# Altium schematic sheet Input_TAB.SchDoc
size A4; SheetNumber: 7; SheetTotal: 9
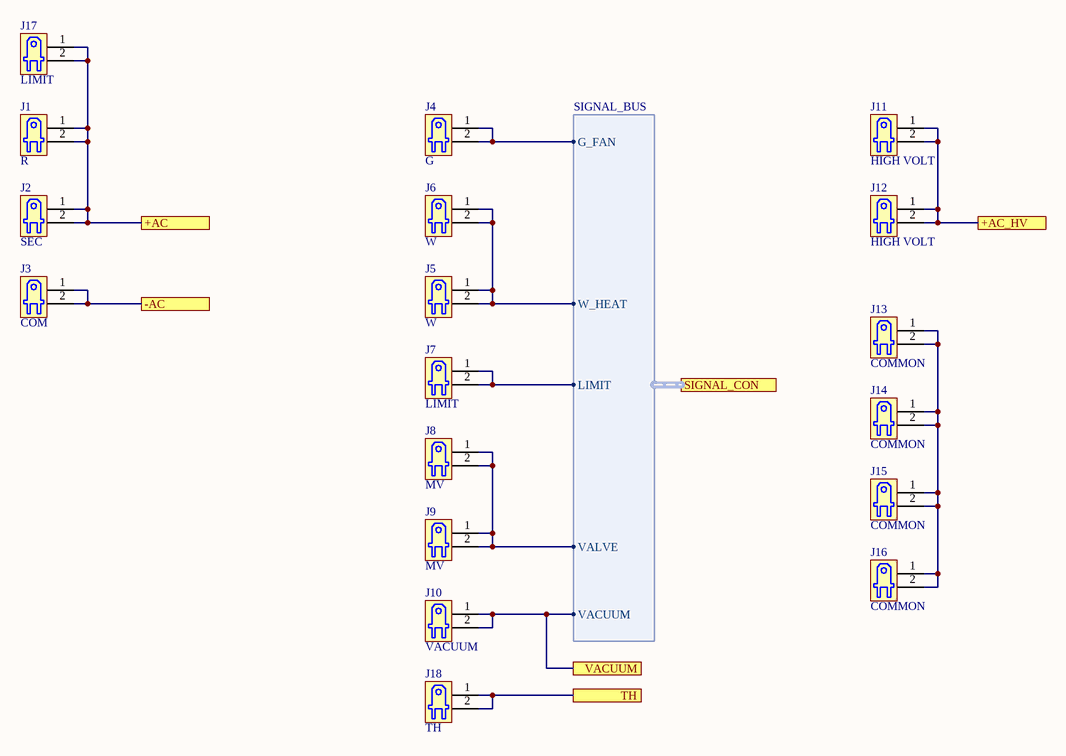
[diagram p0: Input_TAB.SchDoc]

## Parts
J1  R  [TAB250-250P]
J2  SEC  [TAB250-250P]
J3  COM  [TAB250-250P]
J4  G  [TAB250-250P]
J5  W  [TAB250-250P]
J6  W  [TAB250-250P]
J7  LIMIT  [TAB250-250P]
J8  MV  [TAB250-250P]
J9  MV  [TAB250-250P]
J10  VACUUM  [TAB250-250P]
J11  HIGH VOLT  [TAB250-250P]
J12  HIGH VOLT  [TAB250-250P]
J13  COMMON  [TAB250-250P]
J14  COMMON  [TAB250-250P]
J15  COMMON  [TAB250-250P]
J16  COMMON  [TAB250-250P]
J17  LIMIT  [TAB250-250P]
J18  TH  [TAB250-250P]

## Ports
+AC, +AC_HV, -AC, SIGNAL_CON (harness SIGNAL_BUS), TH, VACUUM

## Harnesses
SIGNAL_BUS: G_FAN, LIMIT, VACUUM, VALVE, W_HEAT

## Nets
+AC: J1.1 J1.2 J2.1 J2.2 J17.1 J17.2 ; port +AC
+AC_HV: J11.1 J11.2 J12.1 J12.2 ; port +AC_HV
-AC: J3.1 J3.2 ; port -AC
TH: J18.1 J18.2 ; port TH
VACUUM: J10.1 J10.2 ; port VACUUM, port SIGNAL_CON.VACUUM
NetJ4_1: J4.1 J4.2 ; port SIGNAL_CON.G_FAN
NetJ5_1: J5.1 J5.2 J6.1 J6.2 ; port SIGNAL_CON.W_HEAT
NetJ7_1: J7.1 J7.2 ; port SIGNAL_CON.LIMIT
NetJ8_1: J8.1 J8.2 J9.1 J9.2 ; port SIGNAL_CON.VALVE
NetJ13_1: J13.1 J13.2 J14.1 J14.2 J15.1 J15.2 J16.1 J16.2

## Library data of the parts
J1-J18 = TAB250